# Altium project VFD-Clock.PrjPcb
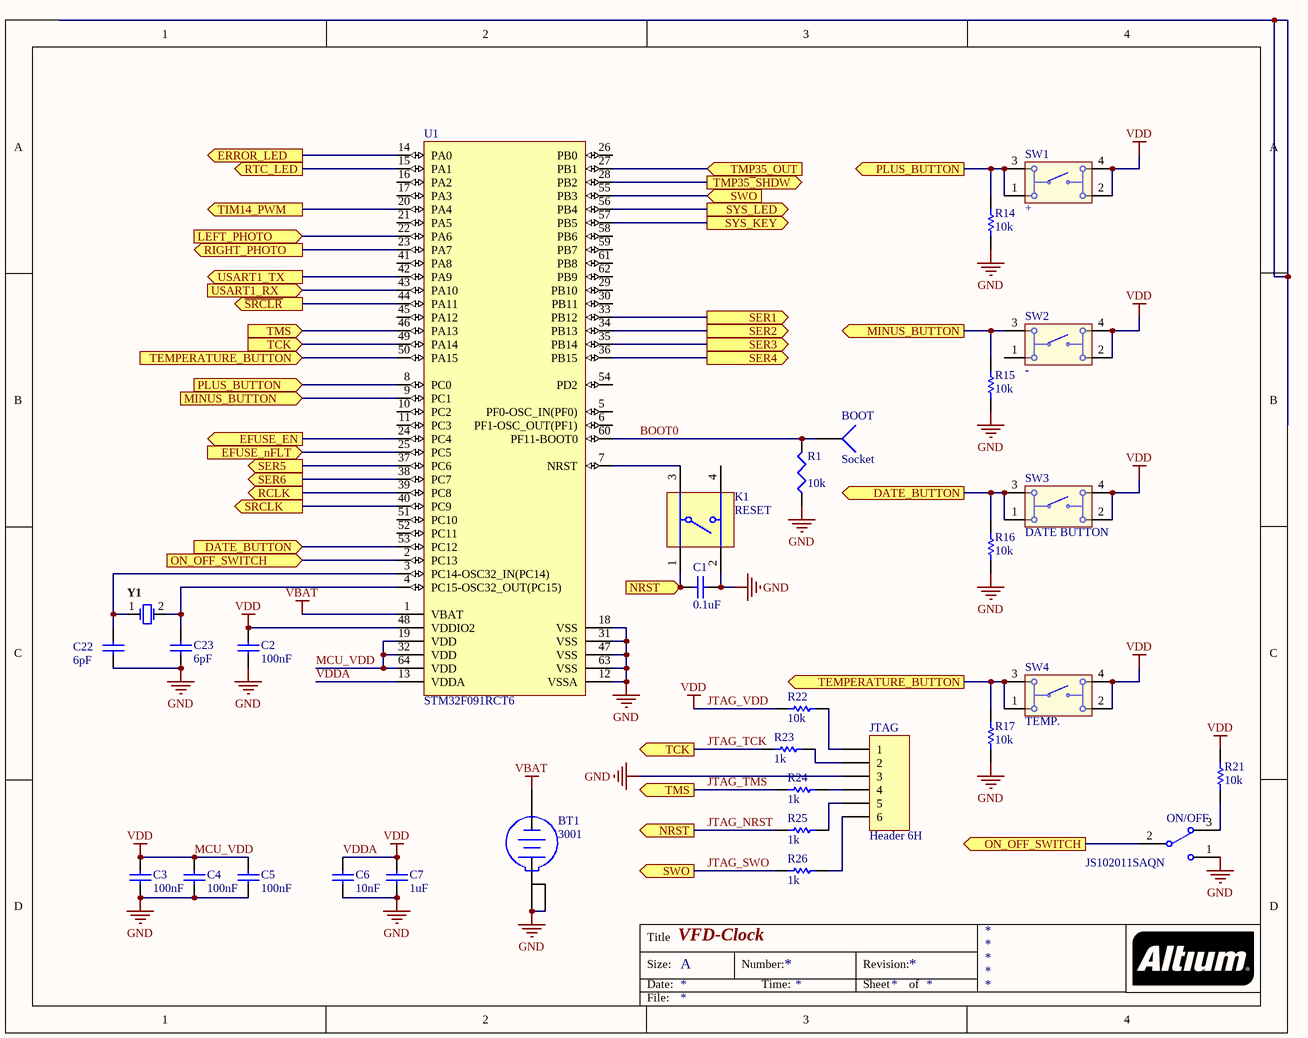
[diagram p0: MCU.SchDoc]
5 sheets, 92 parts. Net scope: flat (ports and power ports of the same name join across sheets).
Board file: VFD_Clock.PcbDoc
Sheets:
  MCU.SchDoc
  Tubes 1-3.SchDoc
  Tubes4-6.SchDoc
  BLE_Sensors_LEDs.SchDoc
  Power.SchDoc

## Sheet MCU.SchDoc: VFD-Clock
size A; Author: Jack Danielski

### Parts
BOOT  Socket  [PIN1]
BT1  3001  [KSTN-3001_V]
C1  0.1uF  [CAPC1608X90X40ML10T20]
C2  100nF  [CAPC1608X90X40ML10T20]
C3  100nF  [CAPC1608X90X40ML10T20]
C4  100nF  [CAPC1608X90X40ML10T20]
C5  100nF  [CAPC1608X90X40ML10T20]
C6  10nF  [CAPC1608X90X40ML10T20]
C7  1uF  [CAPC1608X90X20LL10]
C22  6pF  [CAPC1608X90X40ML10T20]
C23  6pF  [CAPC1608X90X40ML10T20]
JTAG  Header 6H  [HDR1X6H]
K1  RESET  [PNSC-EVPAA_V]
ON/OFF  JS102011SAQN  [CKCP-JS102011SAQN-3_V]
R1  value 10k  [J1-0603]
R14  10k  [RESC1608X55X30LL20T20]
R15  10k  [RESC1608X55X30LL20T20]
R16  10k  [RESC1608X55X30LL20T20]
R17  10k  [RESC1608X55X30LL20T20]
R21  10k  [RESC1608X55X30LL20T20]
R22  10k  [RESC1608X55X30LL20T20]
R23  1k  [RESC1608X55X30LL20T20]
R24  1k  [RESC1608X55X30LL20T20]
R25  1k  [RESC1608X55X30LL20T20]
R26  1k  [RESC1608X55X30LL20T20]
SW1  +  [434331045822]
SW2  -  [434331045822]
SW3  DATE BUTTON  [434331045822]
SW4  TEMP.  [434331045822]
U1  STM32F091RCT6  [STM-LQFP64_L]
Y1  ABS07-120-32.768KHZ-T  [ABRA-ABS07_A_V]  (value not drawn)

### Ports
DATE_BUTTON (in), DATE_BUTTON (out), EFUSE_EN (out), EFUSE_nFLT (in), ERROR_LED (out), LEFT_PHOTO (in), MINUS_BUTTON (in), MINUS_BUTTON (out), NRST (in), NRST (out), ON_OFF_SWITCH (in), ON_OFF_SWITCH (out), PLUS_BUTTON (in), PLUS_BUTTON (out), RCLK (out), RIGHT_PHOTO (out), RTC_LED (out), SER1 (out), SER2 (out), SER3 (out), SER4 (out), SER5 (out), SER6 (out), SRCLK (out), SWO (in), SWO (out), SYS_KEY (out), SYS_LED (out), TCK (in), TCK (out), TEMPERATURE_BUTTON (in), TEMPERATURE_BUTTON (out), TIM14_PWM (out), TMP35_OUT (in), TMP35~{_}SHDW (out), TMS (in), TMS (out), USART1_RX (in), USART1_TX (out), ~{SRCLR} (out)

### Nets
GND: BT1.1(+) BT1.2(+) C1.2 C2.1 C3.1 C4.1 C5.1 C6.2 C7.1 C22.1 C23.1 JTAG.3 K1.2(B) ON/OFF.1 R1.1 R14.1 R15.1 R16.1 R17.1 U1.12(VSSA) U1.18(VSS) U1.31(VSS) U1.47(VSS) U1.63(VSS)
JTAG_VDD: C2.2 C3.2 C4.2 C5.2 C6.1 C7.2 R21.2 R22.2 SW1.2 SW1.4 SW2.2 SW2.4 SW3.2 SW3.4 SW4.2 SW4.4 U1.13(VDDA) U1.19(VDD) U1.32(VDD) U1.48(VDDIO2) U1.64(VDD)  [also labelled MCU_VDD, VDD, VDDA]
VBAT: BT1.3(-) U1.1(VBAT)
BOOT0: BOOT.1 R1.2 U1.60(PF11-BOOT0)
JTAG_NRST: C1.1 K1.1(A) R25.2 ; port NRST
JTAG_SWO: R26.2 U1.55(PB3) ; port SWO
JTAG_TCK: R23.2 U1.49(PA14) ; port TCK
JTAG_TMS: R24.2 U1.46(PA13) ; port TMS
NetC22_2: C22.2 U1.3(PC14-OSC32_IN(PC14)) Y1.1
NetC23_2: C23.2 U1.4(PC15-OSC32_OUT(PC15)) Y1.2
NetJTAG_1: JTAG.1 R22.1
NetJTAG_2: JTAG.2 R23.1
NetJTAG_4: JTAG.4 R24.1
NetJTAG_5: JTAG.5 R25.1
NetJTAG_6: JTAG.6 R26.1
NetK1_3: K1.3(A') U1.7(NRST)
NetON/OFF_2: ON/OFF.2 U1.2(PC13) ; port ON_OFF_SWITCH
NetON/OFF_3: ON/OFF.3 R21.1
NetQ1_1: U1.22(PA6) ; port LEFT_PHOTO
NetQ2_1: U1.23(PA7) ; port RIGHT_PHOTO
NetR2_2: U1.56(PB4) ; port SYS_LED
NetR3_2: U1.57(PB5) ; port SYS_KEY
NetR6_2: U1.14(PA0) ; port ERROR_LED
NetR7_2: U1.15(PA1) ; port RTC_LED
NetR14_2: R14.2 SW1.1 SW1.3 U1.8(PC0) ; port PLUS_BUTTON
NetR15_2: R15.2 SW2.3 U1.9(PC1) ; port MINUS_BUTTON
NetR16_2: R16.2 SW3.1 SW3.3 U1.53(PC12) ; port DATE_BUTTON
NetR17_2: R17.2 SW4.1 SW4.3 U1.50(PA15) ; port TEMPERATURE_BUTTON
NetR18_1: U1.25(PC5) ; port EFUSE_nFLT
NetU1_20: U1.20(PA4) ; port TIM14_PWM
NetU1_27: U1.27(PB1) ; port TMP35_OUT
NetU1_28: U1.28(PB2) ; port TMP35~{_}SHDW
NetU1_33: U1.33(PB12) ; port SER1
NetU1_34: U1.34(PB13) ; port SER2
NetU1_35: U1.35(PB14) ; port SER3
NetU1_36: U1.36(PB15) ; port SER4
NetU1_37: U1.37(PC6) ; port SER5
NetU1_38: U1.38(PC7) ; port SER6
NetU1_39: U1.39(PC8) ; port RCLK
NetU1_40: U1.40(PC9) ; port SRCLK
NetU1_42: U1.42(PA9) ; port USART1_TX
NetU1_43: U1.43(PA10) ; port USART1_RX
NetU1_44: U1.44(PA11) ; port ~{SRCLR}
NetU_3: U1.24(PC4) ; port EFUSE_EN

Not connected (* = marked no-connect by the designer): K1 4(B'); SW2 1; U1 5(PF0-OSC_IN(PF0)) 6(PF1-OSC_OUT(PF1)) 10(PC2) 11(PC3) 16(PA2) 17(PA3) 21(PA5) 26(PB0) 29(PB10) 30(PB11) 41(PA8) 45(PA12) 51(PC10) 52(PC11) 54(PD2) 58(PB6) 59(PB7) 61(PB8) 62(PB9)

### Notes on the sheet
- Title
- Size:
- Date:
- A
- Number:
- Time:
- Revision:
- Sheet
- of
- File:

### Library data of the parts
BT1 = CMP-2000-05463-1: Holder Battery Coin, 12 mm, 2-Pin THD, RoHS; Manufacturer: Keystone; Package Reference: 3001; Package Description: 2-Pin Through Hole Device, Body 13.21 x 12.07 mm; Datasheet Version: Rev. H, 09/2006; Datasheet URL: https://datasheet.ciiva.com/3/3001-3954.pdf; Mounting Technology: ThroughHole; Manufacturer URL: http://www.keyelco.com/
C1-C5 C22 C23 = CMP-2000-05002-1: Ceramic Multilayer Capacitor, 100 nF, +/- 10%, 50 V, -55 to 155 degC, 0603 (1608 Metric), RoHS, Tape and Reel; Manufacturer: Yageo; Online Catalog: CCSeries; Voltage - Rated: 16V; Product Training Modules: MultilayerCeramicCapacitors; Other Names: 311-1088-6; Featured Product: CommodityMultilayerCeramicCapacitors–CCSeries; Capacitance: 0.1µF; Temperature Coefficient: X7R; Height - Seated (Max): -; Operating Temperature: -55degC~125degC; Package / Case: 0603(1608Metric); Datasheet URL: https://datasheet.ciiva.com/11786/0900766b80d84f1d-11786077.pdf; Package Description: 2-Pin Surface Mount Device, Body 1.6 x 0.8 mm; Family: CeramicCapacitors; Packaging: Digi-Reel; Size / Dimension: 0.063"Lx0.031"W(1.60mmx0.80mm); Thickness (Max): 0.035"(0.90mm); Series: CC; Lead Spacing: -; Features: -; Tolerance: ±10%; Lead Style: -; Ratings: -; Manufacturer URL: http://www.yageo.com/; Package Reference: 603; Standard Package: 1; Category: Capacitors; Mounting Type: SurfaceMount,MLCC; Applications: GeneralPurpose; Datasheet Version: Rev. 2, 05/2009
C6 = CMP-2100-03600-1: Chip Capacitor, 10 nF, +/- 10%, 50 V, -55 to 125 degC, 0603 (1608 Metric), RoHS, Tape and Reel; Manufacturer: Yageo; Insulation Resistance: 100GR; Dielectric: X7R; Voltage Rating (DC): 50V; Material: Ceramic; Lead Free: LeadFree; Case/Package: 0603; Datasheet Version: Rev. 15, 10/2016; Composition: Ceramic; Radiation Hardening: No; Thickness: 0.035inch; RoHSCompliant: True; Termination: SMD/SMT; Capacitance: 10nF; Manufacturer URL: http://www.yageo.com/; Tolerance: 10%; REACH SVHC: NoSVHC; Voltage: 50V; Max Operating Temperature: 125degC; Case Code (Metric): 1608; Package Quantity: 1; Case Code (Imperial): 0603; Packaging: TapeandReel; Package Reference: 0603; Width: 0.031inch; Datasheet URL: http://www.yageo.com/documents/recent/UPY-GPHC_X7R_6.3V-to-50V_15.pdf; Length: 1.6mm; Min Operating Temperature: -55degC; Number of Pins: 2; Depth: 0.8mm; Mount: SurfaceMount; Height: 0.8mm; Voltage Rating: 50V; Package Description: 2-Pin Surface Mount Device, Body 1.6 x 0.8 mm
C7 = CMP-2000-06025-1: Chip Capacitor, 1 uF, +/- 10%, 50 V, -55 to 85 degC, 0603 (1608 Metric), RoHS, Tape and Reel; Manufacturer: TDK; PCN Part Number: MLCCPartNumberChange30/Nov/2012; Other Names: 445-7468-6; Online Catalog: CSeries,GeneralPurpose; Capacitance: 1µF; Product Training Modules: CSeriesGeneralApplicationsSEAT,CCV,andTVCLDesignToolsGuidetoReplacinganElectrolyticCapacitorwithanMLCC; Voltage - Rated: 50V; Design Resources: 20WNon-IsolatedBuckLEDDriverUsingPLLNK460KG; Temperature Coefficient: X5R; Series: C; Datasheet Version: 08/2016; Package Description: 2-Pin Surface Mount Device, Body 1.6 x 0.8 mm; Mounting Technology: SurfaceMount; Features: -; Size / Dimension: 0.063"Lx0.031"W(1.60mmx0.80mm); Lead Spacing: -; Operating Temperature: -55°C~85°C; Tolerance: ±10%; Height - Seated (Max): -; Mounting Type: SurfaceMount,MLCC; Ratings: -; Standard Package: 1; Applications: GeneralPurpose; Datasheet URL: https://product.tdk.com/info/en/catalog/datasheets/mlcc_commercial_general_en.pdf; Category: Capacitors; Lead Style: -; Packaging: Digi-Reel®; RoHS Information: RoHSCertificate-MLCC; Package / Case: 0603(1608Metric); Package Reference: 0603; Manufacturer URL: http://www.tdk.com/; Thickness (Max): 0.035"(0.90mm); Family: CeramicCapacitors
JTAG = Header 6H: Header, 6-Pin, Right Angle; LatestRevisionDate: 17-Jul-2002; LatestRevisionNote: Re-released for DXP Platform.; Publisher: Altium Limited
K1 = CMP-2000-06231-1: Light Touch Switch, 100 mOhm, -40 to 85 degC, 4-Pin SMD, RoHS, Tape and Reel; Manufacturer: Panasonic; Part No: EVP-AA002K; Electrical Life: 1000000Cycles; Switch Configuration: N.O.; COO: JP; Actuator Color: Black; Contact Rating @ Voltage: 0.02@15VDCA; Dielectric Strength: 250VAC; Actuator Length: 0.3mm; Ground Terminal: No; Operating Force: 1N; Pole Throw Configuration: SPST; Body Orientation: Straight; Illumination Type: N/R; Maximum DC Voltage Rating: 15V; Actuator Style: RectangularButton; Maximum AC Voltage Rating: N/A; Package Description: 4-Pin Surface Mount Device, Body 2.9 x 3.5 mm, Pitch 1.45 mm; Family: EVPAA; Contact Material: N/A; Mounting: SurfaceMount,J-Bend; Datasheet Version: 04/2016; Housing Material: N/A; Product Weight: N/A; RoHS: Yes; Mechanical Life: N/A; Minimum Insulation Resistance: 100MOhm; Operating Temperature: -40to85C; Mounting Technology: SurfaceMount; HTS: 8507204000; Dimension: 4.3x2.9x1.7mm; Maximum Contact Resistance: 100mOhm; Base Material: N/A; Seal Location: N/A; Supplier Standard Pack: 5,000; Supplier: PanasonicIndustrialDevices; Datasheet URL: https://industrial.panasonic.com/cdbs/www-data/pdf/ATV0000/ATV0000C1.pdf; Packaging: EmbossedTapeandReel; Manufacturer URL: http://www.panasonic.com/; Seal Description: N/A; Contact Plating: N/A; ECCN: EAR99; Package Reference: EVPAA; Type: LightTouch
ON/OFF = CMP-2000-06501-1: Sub-Miniature Slide Switch, SPDT, -40 to 85 degC, 3-Pin SMD, RoHS, Tape and Reel; Manufacturer: C&K Components; Electrical Life: 15000Cycles; Actuator Color: Black; Body Orientation: RightAngle; Minimum Insulation Resistance: 100MOhm; Contact Rating @ Voltage: 0.3@6VDCA; Actuator Style: SideSlide; Maximum DC Voltage Rating: 6V; COO: US; Actuator Material: Nylon4/6; Dielectric Strength: 500VAC; Maximum Contact Resistance: 70mOhm; Base Material: N/A; Mounting Technology: SurfaceMount; Switch Configuration: N/A; Package Reference: SMT; Package Description: 3-Pin Surface Mount Device, Body 9 x 3.6 mm, Height 3.5 mm; Mounting: SurfaceMount,GullWing; Part No: JS102011SAQN; Dimension: 9x4.3mm; Type: Sub-Miniature; Product Weight: N/A; Seal Location: N/A; Family: JS; ECCN: EAR99; Supplier: C&KComponents; Seal Description: N/A; Contact Plating: Silver; Pole Throw Configuration: SPDT; Packaging: TapeandReel; Manufacturer URL: http://www.ckswitches.com/; Datasheet URL: https://datasheet.ciiva.com/1532/js-9dec14-1532400.pdf; Maximum AC Voltage Rating: N/A; Mechanical Life: N/A; HTS: 8536509050; Datasheet Version: 12/2014; Housing Material: Nylon4/6; Contact Material: CopperAlloy; RoHS: Yes; Operating Temperature: -40to85C
R1 = Res3: Resistor; Published: 8-Jun-2000; LatestRevisionDate: 29-May-2009; LatestRevisionNote: IPC-7351 Footprint Added.; PackageReference: J1-0603; Publisher: Altium Limited; PackageDescription: Chip Resistor
R14-R17 R21-R26 = CMP-2000-00873-1: Manufacturer: Panasonic; Part Number: ERA3AEB102V
SW1-SW4 = CMP-1461-00001-1: WS-TASU SMD Tact Switch 4.7X3.5 mm side push; Manufacturer: Wuerth Elektronik; NoPins: 04; ComponentLink1Description: Manufacturer URL; ComponentLink2Description: Datasheet; PartNumber: 434331045822; PackageReference: 434331045822; ComponentLink2URL: http://katalog.we-online.de/em/datasheet/434331045822.pdf; ComponentLink1URL: http://www.we-online.com
U1 = CMP-0304-00199-2: ARM Cortex-M0 32-bit MCU, 256 KB Flash, 32 KB Internal RAM, 52 I/Os, 64-Pin LQFP, -40 to 85 degC, Tray; Manufacturer: STMicroelectronics; I/Os (High Current): 52; FLASH Size (Prog) (kB): 256; Operating Frequency(F) (Processor speed) (MHz): 48; D/A Converter: 1; Supply Voltage(Vcc) min (V): 2; Internal RAM Size (kB): 32; ComponentLink2Description: Datasheet; ComponentLink1Description: Manufacturer URL; Package Reference: LQFP64; Core: ARM Cortex-M0; PartNumber: STM32F091RCT6; Package Description: 64-Pin Low-profile Quad Flat Package, Body 10 x 10 mm, Pitch 0.5 mm; ComponentLink1URL: http://www.st.com/; ComponentLink2URL: http://www.st.com/st-web-ui/static/active/en/resource/technical/document/datasheet/DM00115237.pdf; DatasheetVersion: Rev. 2; Mounting Technology: Surface Mount; Packing: Tray
Y1 = CMP-2000-07587-1: Tuning Fork Crystal, 32.768 KHz, +/- 20 ppm, -40 to 85 degC, 2-Pin SMD, RoHS, Tape and Reel; Manufacturer: Abracon; Case\/Package: SMD/SMT; Series Resistance: 60KOhm; Frequency Tolerance: 20ppm; Load Capacitance: 6pF; ESR (Equivalent Series Resistance): 55KOhm; Max Operating Temperature: 85degC; Width: 0.061inch; Radiation Hardening: No; Lead Free: LeadFree; RoHSCompliant: True; Depth: 1.5mm; Datasheet URL: http://www.abracon.com/Resonators/ABS07-120-32.768kHz-T.pdf; Frequency: 32.768KHz; Termination: SMD/SMT; Manufacturer URL: http://www.abracon.com/; Package Quantity: 3000; Packaging: TapeandReel; Number of Pins: 2; Height: 0.035inch; Package Description: 2-Pin Surface Mount Device, Body 3.2 x 1.5 mm; Package Reference: ABS07; Mount: SurfaceMount; Tolerance: 20ppm; Mounting Technology: SurfaceMount; REACH SVHC: NoSVHC; Datasheet Version: 11/2014; Length: 3.2mm; Min Operating Temperature: -40degC
BOOT = Socket: LatestRevisionDate: 17-Jul-2002; LatestRevisionNote: Re-released for DXP Platform.; Publisher: Altium Limited

## Sheet Tubes 1-3.SchDoc
size A
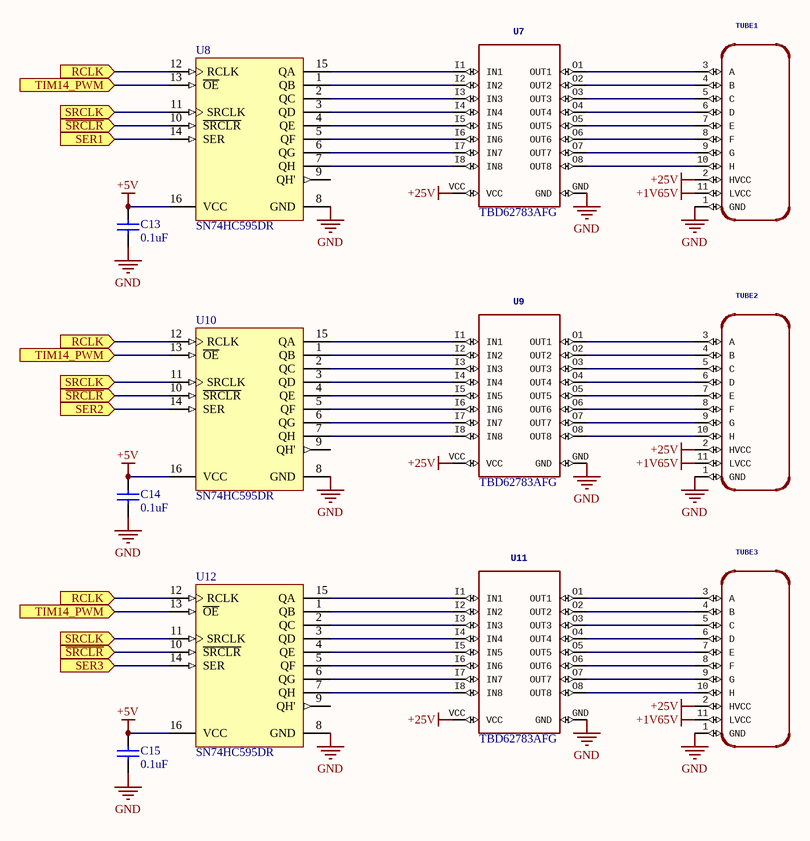
[diagram p1: Tubes 1-3.SchDoc]

### Parts
C13  0.1uF  [CAPC1608X90X40ML10T20]
C14  0.1uF  [CAPC1608X90X40ML10T20]
C15  0.1uF  [CAPC1608X90X40ML10T20]
TUBE1  VFD-IV-11  [VFD-IV11]  (value not drawn)
TUBE2  VFD-IV-11  [VFD-IV11]  (value not drawn)
TUBE3  VFD-IV-11  [VFD-IV11]  (value not drawn)
U7  TBD62783AFG  [TBD62783AFG]
U8  SN74HC595DR  [D0016A_N]
U9  TBD62783AFG  [TBD62783AFG]
U10  SN74HC595DR  [D0016A_N]
U11  TBD62783AFG  [TBD62783AFG]
U12  SN74HC595DR  [D0016A_N]

### Ports
RCLK (in), SER1 (in), SER2 (in), SER3 (in), SRCLK (in), TIM14_PWM (in), ~{SRCLR} (in)

### Nets
+1V65V: TUBE1.11(LVCC) TUBE2.11(LVCC) TUBE3.11(LVCC)
+5V: C13.2 C14.2 C15.2 U8.16(VCC) U10.16(VCC) U12.16(VCC)
+25V: TUBE1.2(HVCC) TUBE2.2(HVCC) TUBE3.2(HVCC) U7.VCC U9.VCC U11.VCC
GND: C13.1 C14.1 C15.1 TUBE1.1(GND) TUBE2.1(GND) TUBE3.1(GND) U7.GND U8.8(GND) U9.GND U10.8(GND) U11.GND U12.8(GND)
NetTUBE1_3: TUBE1.3(A) U7.O1(OUT1)
NetTUBE1_4: TUBE1.4(B) U7.O2(OUT2)
NetTUBE1_5: TUBE1.5(C) U7.O3(OUT3)
NetTUBE1_6: TUBE1.6(D) U7.O4(OUT4)
NetTUBE1_7: TUBE1.7(E) U7.O5(OUT5)
NetTUBE1_8: TUBE1.8(F) U7.O6(OUT6)
NetTUBE1_9: TUBE1.9(G) U7.O7(OUT7)
NetTUBE1_10: TUBE1.10(H) U7.O8(OUT8)
NetTUBE2_3: TUBE2.3(A) U9.O1(OUT1)
NetTUBE2_4: TUBE2.4(B) U9.O2(OUT2)
NetTUBE2_5: TUBE2.5(C) U9.O3(OUT3)
NetTUBE2_6: TUBE2.6(D) U9.O4(OUT4)
NetTUBE2_7: TUBE2.7(E) U9.O5(OUT5)
NetTUBE2_8: TUBE2.8(F) U9.O6(OUT6)
NetTUBE2_9: TUBE2.9(G) U9.O7(OUT7)
NetTUBE2_10: TUBE2.10(H) U9.O8(OUT8)
NetTUBE3_3: TUBE3.3(A) U11.O1(OUT1)
NetTUBE3_4: TUBE3.4(B) U11.O2(OUT2)
NetTUBE3_5: TUBE3.5(C) U11.O3(OUT3)
NetTUBE3_6: TUBE3.6(D) U11.O4(OUT4)
NetTUBE3_7: TUBE3.7(E) U11.O5(OUT5)
NetTUBE3_8: TUBE3.8(F) U11.O6(OUT6)
NetTUBE3_9: TUBE3.9(G) U11.O7(OUT7)
NetTUBE3_10: TUBE3.10(H) U11.O8(OUT8)
NetU1_20: U8.13(~{OE}) U10.13(~{OE}) U12.13(~{OE}) ; port TIM14_PWM
NetU1_33: U8.14(SER) ; port SER1
NetU1_34: U10.14(SER) ; port SER2
NetU1_35: U12.14(SER) ; port SER3
NetU1_39: U8.12(RCLK) U10.12(RCLK) U12.12(RCLK) ; port RCLK
NetU1_40: U8.11(SRCLK) U10.11(SRCLK) U12.11(SRCLK) ; port SRCLK
NetU1_44: U8.10(~{SRCLR}) U10.10(~{SRCLR}) U12.10(~{SRCLR}) ; port ~{SRCLR}
NetU7_I1: U7.I1(IN1) U8.15(QA)
NetU7_I2: U7.I2(IN2) U8.1(QB)
NetU7_I3: U7.I3(IN3) U8.2(QC)
NetU7_I4: U7.I4(IN4) U8.3(QD)
NetU7_I5: U7.I5(IN5) U8.4(QE)
NetU7_I6: U7.I6(IN6) U8.5(QF)
NetU7_I7: U7.I7(IN7) U8.6(QG)
NetU7_I8: U7.I8(IN8) U8.7(QH)
NetU9_I1: U9.I1(IN1) U10.15(QA)
NetU9_I2: U9.I2(IN2) U10.1(QB)
NetU9_I3: U9.I3(IN3) U10.2(QC)
NetU9_I4: U9.I4(IN4) U10.3(QD)
NetU9_I5: U9.I5(IN5) U10.4(QE)
NetU9_I6: U9.I6(IN6) U10.5(QF)
NetU9_I7: U9.I7(IN7) U10.6(QG)
NetU9_I8: U9.I8(IN8) U10.7(QH)
NetU11_I1: U11.I1(IN1) U12.15(QA)
NetU11_I2: U11.I2(IN2) U12.1(QB)
NetU11_I3: U11.I3(IN3) U12.2(QC)
NetU11_I4: U11.I4(IN4) U12.3(QD)
NetU11_I5: U11.I5(IN5) U12.4(QE)
NetU11_I6: U11.I6(IN6) U12.5(QF)
NetU11_I7: U11.I7(IN7) U12.6(QG)
NetU11_I8: U11.I8(IN8) U12.7(QH)

Not connected (* = marked no-connect by the designer): U8 9(QH'); U10 9(QH'); U12 9(QH')

### Library data of the parts
C13-C15 = CMP-2000-05002-1: as C1 on sheet MCU; Height - Seated (Max): -; Operating Temperature: -55degC~125degC; Package / Case: 0603(1608Metric); Datasheet URL: https://datasheet.ciiva.com/11786/0900766b80d84f1d-11786077.pdf; Package Description: 2-Pin Surface Mount Device, Body 1.6 x 0.8 mm; Family: CeramicCapacitors; Packaging: Digi-Reel; Size / Dimension: 0.063"Lx0.031"W(1.60mmx0.80mm); Thickness (Max): 0.035"(0.90mm); Series: CC; Lead Spacing: -; Features: -; Tolerance: ±10%; Lead Style: -; Ratings: -; Manufacturer URL: http://www.yageo.com/; Package Reference: 603; Standard Package: 1; Category: Capacitors; Mounting Type: SurfaceMount,MLCC; Applications: GeneralPurpose; Datasheet Version: Rev. 2, 05/2009
TUBE1-TUBE3 = VFD-IV-11: GateName_1: G$1; SymbolName_1: VFD-IV11; LibraryName: VFD-Clock; DeviceSetName: VFD-IV-11; Package: VFD-IV11
U7 = TBD62783AFG: TUBE1; GateName_1: G$1; SymbolName_1: TBD62783AFG; LibraryName: TBD62783AFG; DeviceSetName: TBD62783AFG; Package: TBD62783AFG
U8 U10 U12 = CMP-0780-00037-3: 8-Bit Shift Registers With 3-State Output Registers, D0016A, LARGE T&R; Manufacturer: Texas Instruments; Output Drive (IOL/IOH)(Max)(mA): 7.8/-7.8; Rating: Military; ICC @ Nom Voltage(Max)(mA): 0.08; VCC(Min)(V): 2; tpd @ Nom Voltage(Max)(ns): 34; 3-State Output: Yes; Output Type: CMOS; Voltage(Nom)(V): 6; F @ Nom Voltage(Max)(Mhz): 28; Technology Family: HC; Bits: 4; PackageReference: D0016A; Code_JEDEC: MS-012 variation AC; Generic Part Number: SN74HC595; Operating Temperature Range(C): -40 to 85; DatasheetVersion: SCLS041H; PackageVersion: http://www.ti.com/lit/ml/mpds178g/mpds178g.pdf; Input Type: CMOS; VCC(Max)(V): 6
U9 = TBD62783AFG: TUBE2; GateName_1: G$1; SymbolName_1: TBD62783AFG; LibraryName: TBD62783AFG; DeviceSetName: TBD62783AFG; Package: TBD62783AFG
U11 = TBD62783AFG: TUBE3; GateName_1: G$1; SymbolName_1: TBD62783AFG; LibraryName: TBD62783AFG; DeviceSetName: TBD62783AFG; Package: TBD62783AFG

## Sheet Tubes4-6.SchDoc
size A
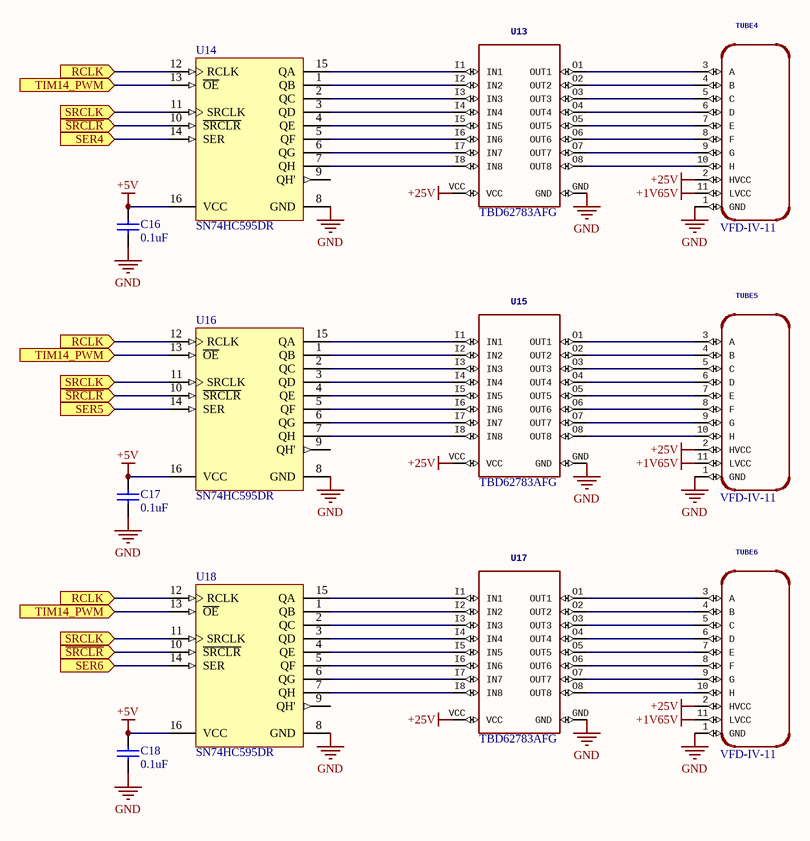
[diagram p2: Tubes4-6.SchDoc]

### Parts
C16  0.1uF  [CAPC1608X90X40ML10T20]
C17  0.1uF  [CAPC1608X90X40ML10T20]
C18  0.1uF  [CAPC1608X90X40ML10T20]
TUBE4  VFD-IV-11  [VFD-IV11]
TUBE5  VFD-IV-11  [VFD-IV11]
TUBE6  VFD-IV-11  [VFD-IV11]
U13  TBD62783AFG  [TBD62783AFG]
U14  SN74HC595DR  [D0016A_N]
U15  TBD62783AFG  [TBD62783AFG]
U16  SN74HC595DR  [D0016A_N]
U17  TBD62783AFG  [TBD62783AFG]
U18  SN74HC595DR  [D0016A_N]

### Ports
RCLK (in), SER4 (in), SER5 (in), SER6 (in), SRCLK (in), TIM14_PWM (in), ~{SRCLR} (in)

### Nets
+1V65V: TUBE4.11(LVCC) TUBE5.11(LVCC) TUBE6.11(LVCC)
+5V: C16.2 C17.2 C18.2 U14.16(VCC) U16.16(VCC) U18.16(VCC)
+25V: TUBE4.2(HVCC) TUBE5.2(HVCC) TUBE6.2(HVCC) U13.VCC U15.VCC U17.VCC
GND: C16.1 C17.1 C18.1 TUBE4.1(GND) TUBE5.1(GND) TUBE6.1(GND) U13.GND U14.8(GND) U15.GND U16.8(GND) U17.GND U18.8(GND)
NetTUBE4_3: TUBE4.3(A) U13.O1(OUT1)
NetTUBE4_4: TUBE4.4(B) U13.O2(OUT2)
NetTUBE4_5: TUBE4.5(C) U13.O3(OUT3)
NetTUBE4_6: TUBE4.6(D) U13.O4(OUT4)
NetTUBE4_7: TUBE4.7(E) U13.O5(OUT5)
NetTUBE4_8: TUBE4.8(F) U13.O6(OUT6)
NetTUBE4_9: TUBE4.9(G) U13.O7(OUT7)
NetTUBE4_10: TUBE4.10(H) U13.O8(OUT8)
NetTUBE5_3: TUBE5.3(A) U15.O1(OUT1)
NetTUBE5_4: TUBE5.4(B) U15.O2(OUT2)
NetTUBE5_5: TUBE5.5(C) U15.O3(OUT3)
NetTUBE5_6: TUBE5.6(D) U15.O4(OUT4)
NetTUBE5_7: TUBE5.7(E) U15.O5(OUT5)
NetTUBE5_8: TUBE5.8(F) U15.O6(OUT6)
NetTUBE5_9: TUBE5.9(G) U15.O7(OUT7)
NetTUBE5_10: TUBE5.10(H) U15.O8(OUT8)
NetTUBE6_3: TUBE6.3(A) U17.O1(OUT1)
NetTUBE6_4: TUBE6.4(B) U17.O2(OUT2)
NetTUBE6_5: TUBE6.5(C) U17.O3(OUT3)
NetTUBE6_6: TUBE6.6(D) U17.O4(OUT4)
NetTUBE6_7: TUBE6.7(E) U17.O5(OUT5)
NetTUBE6_8: TUBE6.8(F) U17.O6(OUT6)
NetTUBE6_9: TUBE6.9(G) U17.O7(OUT7)
NetTUBE6_10: TUBE6.10(H) U17.O8(OUT8)
NetU1_20: U14.13(~{OE}) U16.13(~{OE}) U18.13(~{OE}) ; port TIM14_PWM
NetU1_36: U14.14(SER) ; port SER4
NetU1_37: U16.14(SER) ; port SER5
NetU1_38: U18.14(SER) ; port SER6
NetU1_39: U14.12(RCLK) U16.12(RCLK) U18.12(RCLK) ; port RCLK
NetU1_40: U14.11(SRCLK) U16.11(SRCLK) U18.11(SRCLK) ; port SRCLK
NetU1_44: U14.10(~{SRCLR}) U16.10(~{SRCLR}) U18.10(~{SRCLR}) ; port ~{SRCLR}
NetU13_I1: U13.I1(IN1) U14.15(QA)
NetU13_I2: U13.I2(IN2) U14.1(QB)
NetU13_I3: U13.I3(IN3) U14.2(QC)
NetU13_I4: U13.I4(IN4) U14.3(QD)
NetU13_I5: U13.I5(IN5) U14.4(QE)
NetU13_I6: U13.I6(IN6) U14.5(QF)
NetU13_I7: U13.I7(IN7) U14.6(QG)
NetU13_I8: U13.I8(IN8) U14.7(QH)
NetU15_I1: U15.I1(IN1) U16.15(QA)
NetU15_I2: U15.I2(IN2) U16.1(QB)
NetU15_I3: U15.I3(IN3) U16.2(QC)
NetU15_I4: U15.I4(IN4) U16.3(QD)
NetU15_I5: U15.I5(IN5) U16.4(QE)
NetU15_I6: U15.I6(IN6) U16.5(QF)
NetU15_I7: U15.I7(IN7) U16.6(QG)
NetU15_I8: U15.I8(IN8) U16.7(QH)
NetU17_I1: U17.I1(IN1) U18.15(QA)
NetU17_I2: U17.I2(IN2) U18.1(QB)
NetU17_I3: U17.I3(IN3) U18.2(QC)
NetU17_I4: U17.I4(IN4) U18.3(QD)
NetU17_I5: U17.I5(IN5) U18.4(QE)
NetU17_I6: U17.I6(IN6) U18.5(QF)
NetU17_I7: U17.I7(IN7) U18.6(QG)
NetU17_I8: U17.I8(IN8) U18.7(QH)

Not connected (* = marked no-connect by the designer): U14 9(QH'); U16 9(QH'); U18 9(QH')

### Library data of the parts
C16-C18 = CMP-2000-05002-1: as C1 on sheet MCU; Height - Seated (Max): -; Operating Temperature: -55degC~125degC; Package / Case: 0603(1608Metric); Datasheet URL: https://datasheet.ciiva.com/11786/0900766b80d84f1d-11786077.pdf; Package Description: 2-Pin Surface Mount Device, Body 1.6 x 0.8 mm; Family: CeramicCapacitors; Packaging: Digi-Reel; Size / Dimension: 0.063"Lx0.031"W(1.60mmx0.80mm); Thickness (Max): 0.035"(0.90mm); Series: CC; Lead Spacing: -; Features: -; Tolerance: ±10%; Lead Style: -; Ratings: -; Manufacturer URL: http://www.yageo.com/; Package Reference: 603; Standard Package: 1; Category: Capacitors; Mounting Type: SurfaceMount,MLCC; Applications: GeneralPurpose; Datasheet Version: Rev. 2, 05/2009
TUBE4-TUBE6 = VFD-IV-11: GateName_1: G$1; SymbolName_1: VFD-IV11; LibraryName: VFD-Clock; DeviceSetName: VFD-IV-11; Package: VFD-IV11
U13 = TBD62783AFG: TUBE4; GateName_1: G$1; SymbolName_1: TBD62783AFG; LibraryName: TBD62783AFG; DeviceSetName: TBD62783AFG; Package: TBD62783AFG
U14 U16 U18 = CMP-0780-00037-3: as U8 on sheet Tubes 1-3; PackageReference: D0016A; Code_JEDEC: MS-012 variation AC; Generic Part Number: SN74HC595; Operating Temperature Range(C): -40 to 85; DatasheetVersion: SCLS041H; PackageVersion: http://www.ti.com/lit/ml/mpds178g/mpds178g.pdf; Input Type: CMOS; VCC(Max)(V): 6
U15 = TBD62783AFG: TUBE5; GateName_1: G$1; SymbolName_1: TBD62783AFG; LibraryName: TBD62783AFG; DeviceSetName: TBD62783AFG; Package: TBD62783AFG
U17 = TBD62783AFG: TUBE6; GateName_1: G$1; SymbolName_1: TBD62783AFG; LibraryName: TBD62783AFG; DeviceSetName: TBD62783AFG; Package: TBD62783AFG

## Sheet BLE_Sensors_LEDs.SchDoc
size A
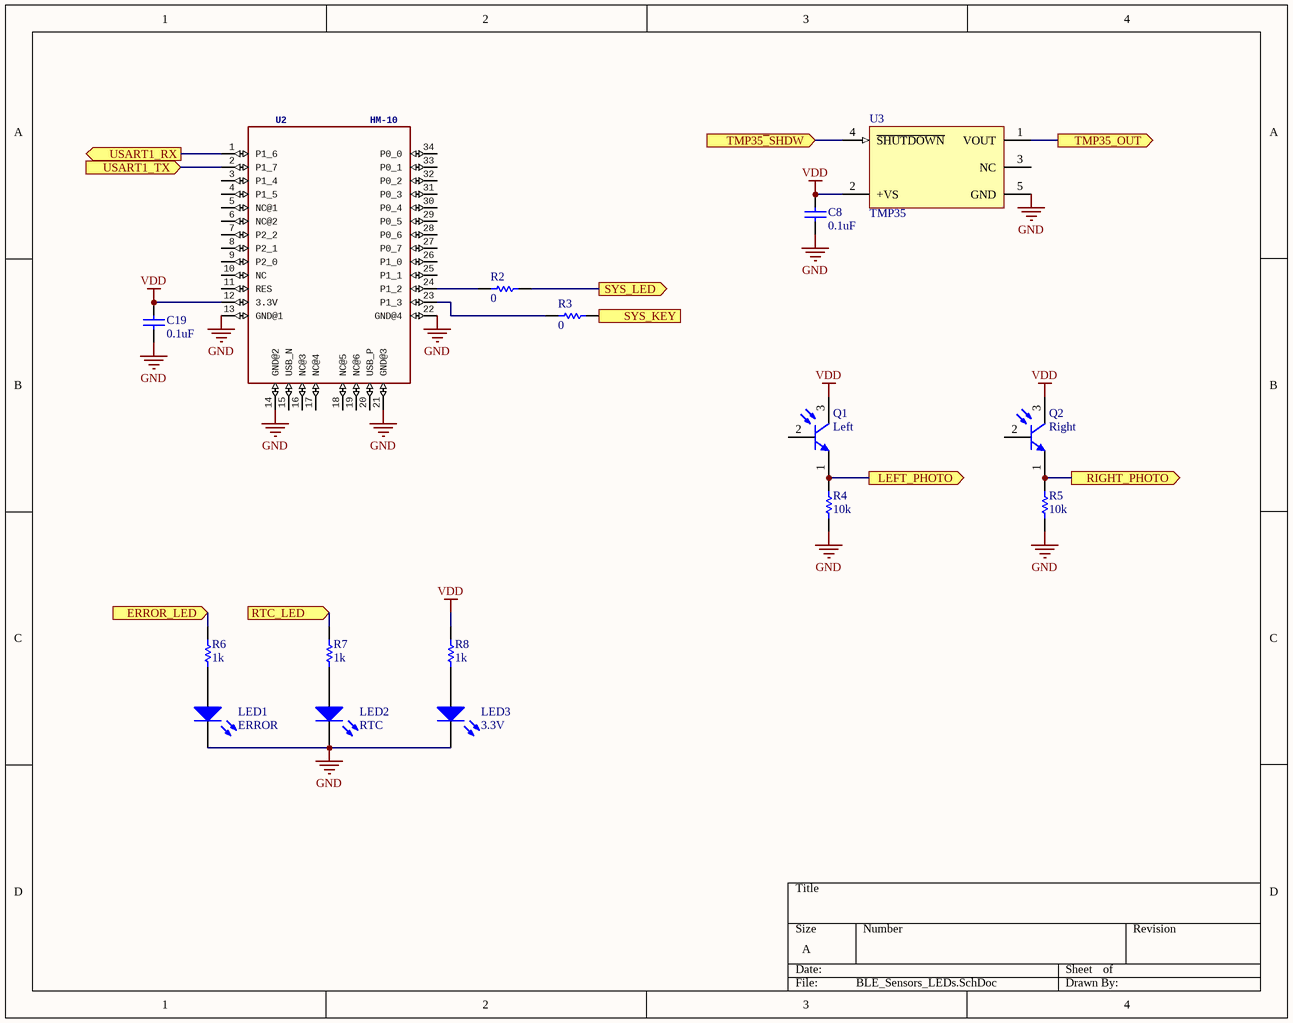
[diagram p3: BLE_Sensors_LEDs.SchDoc]

### Parts
C8  0.1uF  [CAPC1608X90X40ML10T20]
C19  0.1uF  [CAPC1608X90X40ML10T20]
LED1  ERROR  [0805_A]
LED2  RTC  [0805_A]
LED3  3.3V  [0805_A]
Q1  Left  [VSIL-TEMT6000X01_V]
Q2  Right  [VSIL-TEMT6000X01_V]
R2  0  [RESC2013X50X30LL20T20]
R3  0  [RESC2013X50X30LL20T20]
R4  10k  [RESC1608X55X30LL15T15]
R5  10k  [RESC1608X55X30LL15T15]
R6  1k  [RESC1608X55X30LL20T20]
R7  1k  [RESC1608X55X30LL20T20]
R8  1k  [RESC1608X55X30LL20T20]
U2  HM-10  [HM-10]
U3  TMP35  [ADI-RJ-5_M]

### Ports
ERROR_LED (in), LEFT_PHOTO (out), RIGHT_PHOTO (out), RTC_LED (in), SYS_KEY (in), SYS_LED (out), TMP35_OUT (out), TMP35~{_}SHDW (in), USART1_RX (out), USART1_TX (in)

### Nets
GND: C8.1 C19.1 LED1.1(K) LED2.1(K) LED3.1(K) R4.1 R5.1 U2.13(GND@1) U2.14(GND@2) U2.21(GND@3) U2.22(GND@4) U3.5(GND)
VDD: C8.2 C19.2 Q1.3(C) Q2.3(C) R8.2 U2.12(3.3V) U3.2(+VS)  [project net JTAG_VDD]
NetLED1_2: LED1.2(A) R6.1
NetLED2_2: LED2.2(A) R7.1
NetLED3_2: LED3.2(A) R8.1
NetQ1_1: Q1.1(E) R4.2 ; port LEFT_PHOTO
NetQ2_1: Q2.1(E) R5.2 ; port RIGHT_PHOTO
NetR2_1: R2.1 U2.24(P1_2)
NetR2_2: R2.2 ; port SYS_LED
NetR3_1: R3.1 U2.23(P1_3)
NetR3_2: R3.2 ; port SYS_KEY
NetR6_2: R6.2 ; port ERROR_LED
NetR7_2: R7.2 ; port RTC_LED
NetU1_27: U3.1(VOUT) ; port TMP35_OUT
NetU1_28: U3.4(~{SHUTDOWN}) ; port TMP35~{_}SHDW
NetU1_42: U2.2(P1_7) ; port USART1_TX
NetU1_43: U2.1(P1_6) ; port USART1_RX

Not connected (* = marked no-connect by the designer): Q1 2(B); Q2 2(B); U2 3(P1_4) 4(P1_5) 5(NC@1) 6(NC@2) 7(P2_2) 8(P2_1) 9(P2_0) 10(NC) 11(RES) 15(USB_N) 16(NC@3) 17(NC@4) 18(NC@5) 19(NC@6) 20(USB_P) 25(P1_1) 26(P1_0) 27(P0_7) 28(P0_6) 29(P0_5) 30(P0_4) 31(P0_3) 32(P0_2) 33(P0_1) 34(P0_0); U3 3(NC)

### Library data of the parts
C8 C19 = CMP-2000-05002-1: as C1 on sheet MCU; Height - Seated (Max): -; Operating Temperature: -55degC~125degC; Package / Case: 0603(1608Metric); Datasheet URL: https://datasheet.ciiva.com/11786/0900766b80d84f1d-11786077.pdf; Package Description: 2-Pin Surface Mount Device, Body 1.6 x 0.8 mm; Family: CeramicCapacitors; Packaging: Digi-Reel; Size / Dimension: 0.063"Lx0.031"W(1.60mmx0.80mm); Thickness (Max): 0.035"(0.90mm); Series: CC; Lead Spacing: -; Features: -; Tolerance: ±10%; Lead Style: -; Ratings: -; Manufacturer URL: http://www.yageo.com/; Package Reference: 603; Standard Package: 1; Category: Capacitors; Mounting Type: SurfaceMount,MLCC; Applications: GeneralPurpose; Datasheet Version: Rev. 2, 05/2009
LED1-LED3 = CMP-1426-00010-1: SMD mono-color Chip LED, WL-SMCW, Super Red; Manufacturer: Wuerth Elektronik; PartNumber: 150080SS75000; PackageReference: 0805_A; ComponentLink2URL: http://katalog.we-online.com/led/datasheet/150080SS75000.pdf; ComponentLink1URL: http://www.we-online.com; Color: Super Red; ComponentLink2Description: Datasheet; ComponentLink1Description: Manufacturer URL
Q1 Q2 = CMP-1666-00035-1: Ambient Light Sensor / , 100 mW, -40 to 100 degC, 3-Pin SMD, RoHS, Tape and Reel; Nominal Vf: 2 V; Luminous Intensity: 54 mcd; Forward Current: 20 mA; Viewing Angle: 130 degrees; Lens Style: Diffused; Power Rating: 75 mW; Colour: Red; Case\Package: 0603; Case Code (Imperial): 0603; Package Quantity: 3000; Packaging: Tape and Reel; Width: 0.8 mm; ComponentLink2URL: http://www.vishay.com/docs/81579/temt6000.pdf; ComponentLink1Description: Manufacturer URL; ComponentLink2Description: Datasheet; Height: 0.8 mm; Mount: Surface Mount; Pins: 2; Case Code (Metric): 1608; Max Operating Temperature: 85 degC; DatasheetVersion: Rev. 1.9, 08/2011; Forward Voltage: 2 V; ComponentLink1URL: http://www.vishay.com/; Radiation Hardening: No; RoHSCompliant: true; Length: 1.6 mm; PackageReference: 1206; Min Operating Temperature: -55 degC; PackageDescription: 3-Pin Surface Mount Device, Body 4 x 2 mm; Illumination Colour: Red
R2 R3 = CMP-2001-04896-1: Manufacturer: Vishay Dale; Part Number: CRCW08050000Z0EA
R4 R5 = CMP-2000-00181-1: Part Number: ERJ-3EKF1002V; Manufacturer: Panasonic
R6-R8 = CMP-2000-00873-1: as R14 on sheet MCU
U2 = HM-10: GateName_1: G$1; SymbolName_1: HM-10; LibraryName: HM-10_BLE; DeviceSetName: HM-10; Package: HM-10
U3 = CMP-0887-00046-1: Voltage Output Temperature Sensor, 2.7 to 5.5 V Supply, Industrial, 5-pin SOT23 (RJ-5), Reel; PartNumber: TMP35GRTZ-REEL7; Manufacturer: Analog Devices; Mounting Technology: Surface Mount; ComponentLink1URL: http://www.analog.com/en/index.html; ComponentLink2Description: Datasheet; ComponentLink4Description: Product URL; Supply Voltage Range: 2.7 to 5.5 V; ComponentLink1Description: Manufacturer URL; ComponentLink4URL: http://www.analog.com/en/mems-sensors/digital-temperature-sensors/tmp35/products/product.html; ComponentLink3URL: http://www.analog.com/static/imported-files/packages/PKG_PDF/SOT-23(RJ)/RJ_5.pdf; PackageVersion: 121608-A , 12/2008; ComponentLink3Description: Package Specification; PackageReference: RJ-5; ComponentLink2URL: http://www.analog.com/static/imported-files/data_sheets/TMP35_36_37.pdf; DatasheetVersion: Rev. F; Packing: Reel; Code_JEDEC: MO-178-AA; PackageDescription: 5-Pin Small Outline Transistor Package, Body 2.9 x 1.6 mm, Pitch 0.95 mm

## Sheet Power.SchDoc
size A
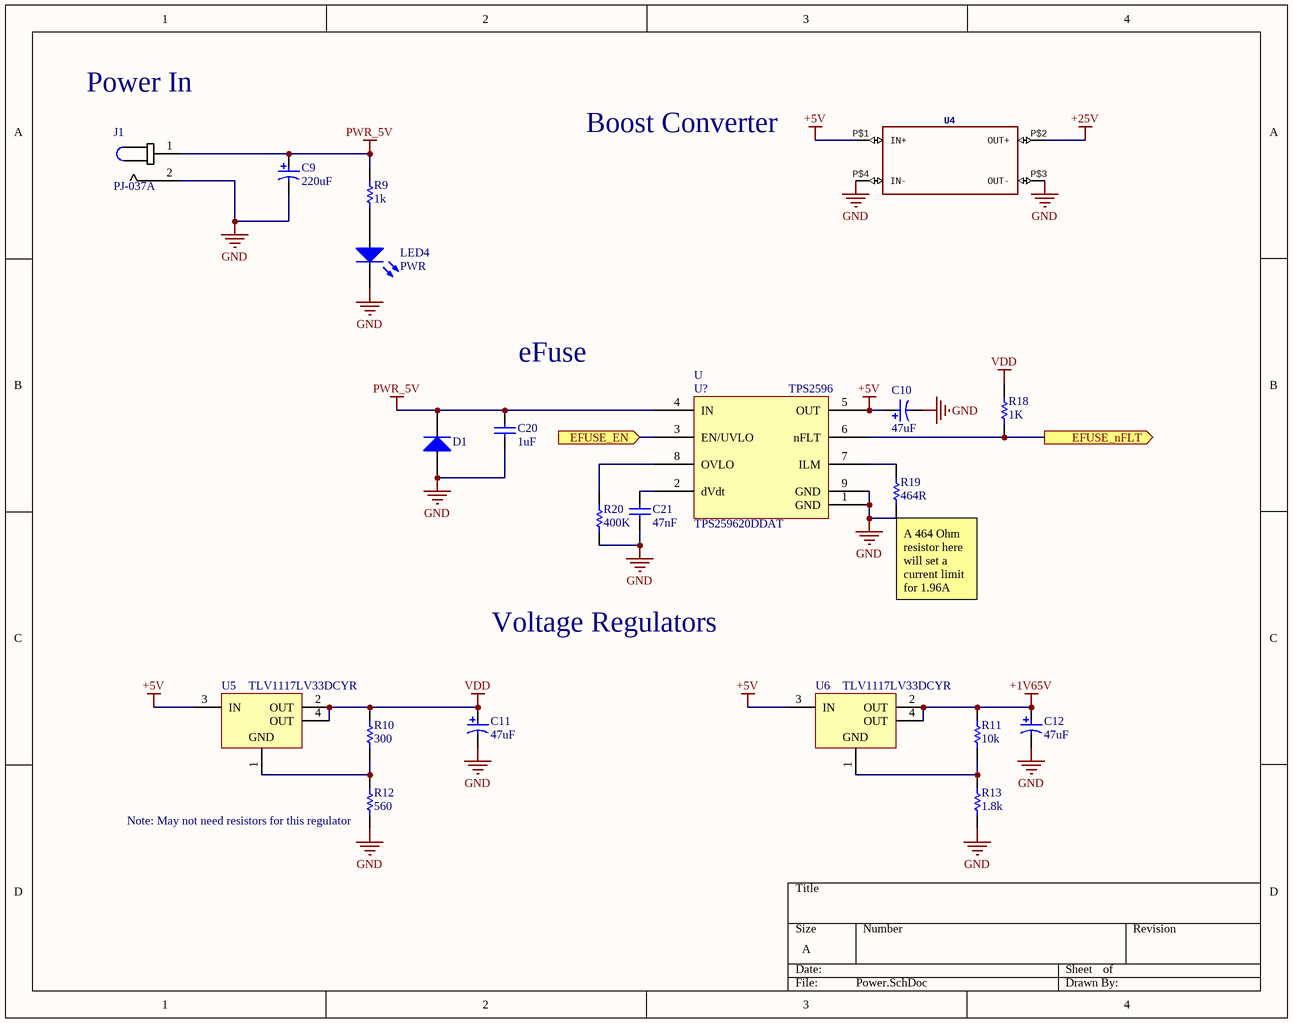
[diagram p4: Power.SchDoc]

### Parts
C9  220uF  [PNSC-FP-V-F_V]
C10  47uF  [PNSC-FP-V-D_V]
C11  47uF  [PNSC-FP-V-D_V]
C12  47uF  [PNSC-FP-V-D_V]
C20  1uF  [CAPC1608X90X20LL10]
C21  47nF  [CAPC1608X90X35ML10T15]
D1  SMAJ5.0A-E3/61  [VISH-DO-214AC-2_M]  (value not drawn)
J1  PJ-037A  [*CUI_PJ-037A]
LED4  PWR  [0805_A]
R9  1k  [RESC1608X55X30LL20T20]
R10  300  [RESC1608X55X30LL15T15]
R11  10k  [RESC1608X55X30LL15T15]
R12  560  [RESC1608X55X30LL20T20]
R13  1.8k  [RESC1609X50X30NL10T20]
R18  1K  [RESC1608X55X30LL15T15]
R19  464R  [RESC1608X55X30LL15T15]
R20  400K  [RESC1608X55X30LL15T15]
U  TPS259620DDAT  [TPS259620DDAT - duplicate]
U4  XL6009E1  [XL6009E1]  (value not drawn)
U5  TLV1117LV33DCYR  [DCY0004A_M]
U6  TLV1117LV33DCYR  [DCY0004A_M]

### Ports
EFUSE_EN (in), EFUSE_nFLT (out)

### Nets
+1V65V: C12.1 R11.2 U6.2(OUT) U6.4(OUT)
+5V: C10.1 U.5(OUT) U4.P$1(IN+) U5.3(IN) U6.3(IN)
+25V: U4.P$2(OUT+)
GND: C9.2 C10.2 C11.2 C12.2 C20.1 C21.1 D1.2(A) J1.2 LED4.1(K) R12.1 R13.2 R19.1 R20.1 U.1(GND) U.9(GND) U4.P$3(OUT-) U4.P$4(IN-)
PWR_5V: C9.1 C20.2 D1.1(K) J1.1 R9.2 U.4(IN)
VDD: C11.1 R10.2 R18.2 U5.2(OUT) U5.4(OUT)  [project net JTAG_VDD]
NetC21_2: C21.2 U.2(dVdt)
NetLED4_2: LED4.2(A) R9.1
NetR10_1: R10.1 R12.2 U5.1(GND)
NetR11_1: R11.1 R13.1 U6.1(GND)
NetR18_1: R18.1 U.6(nFLT) ; port EFUSE_nFLT
NetR19_2: R19.2 U.7(ILM)
NetR20_2: R20.2 U.8(OVLO)
NetU_3: U.3(EN/UVLO) ; port EFUSE_EN

### Notes on the sheet
- Power In
- Boost Converter
- eFuse
- Voltage Regulators
- (near R19) A 464 Ohm resistor here will set a current limit for 1.96A
- (near R12) Note: May not need resistors for this regulator
- (in symbol TI_TPS259620DDAT) U?; TPS2596

### Library data of the parts
C9 = CMP-2000-06215-1: Aluminum Electrolytic Capacitor, 220 uF, +/- 20%, 35 V, 2-Pin SMD (Size Code F), -55 to 105 degC, RoHS, Tape and Reel; Manufacturer: Panasonic; ESR: 0.08ohm; Ripple Current AC: 850mA; Capacitance: 220µF; External Length / Height: 10.2mm; SVHC: ToBeAdvised; Life Time @ Temperature: 2000hours@105°C; Voltage Rating: 35V; Capacitor Case Style: RadialCan-SMD; Leakage Current: 7.7µA; Product Range: PANASONIC-FPSeries; Diameter: 8mm; Datasheet URL: http://industrial.panasonic.com/cdbs/www-data/pdf/RDE0000/ABA0000C1184.pdf; Manufacturer URL: http://www.panasonic.com/; Series: FP; Operating Temperature Max: 105°C; Package Description: 2-Pin Electrolytic Aluminum Capacitor, Body 8.3 x 8.3 mm; Package Reference: FP-V-F; Lifetime @ Temperature: 2000hours@105°C; Operating Temperature Range: -55°Cto+105°C; Package URL: http://industrial.panasonic.com/cdbs/www-data/pdf/RDE0000/DME0000COL48.pdf; Capacitance Tolerance ±: ±20%; AE Capacitor Case: RadialCan-SMD; Height: 10.2mm; Mounting Technology: SurfaceMount; Datasheet Version: 03/2016; Packaging: CutTape; Operating Temperature Min: -55°C; Capacitance Tolerance: ±20%
C10-C12 = CMP-2000-06216-1: Aluminum Electrolytic Capacitor, 47 uF, +/- 20%, 35 V, 2-Pin SMD (Size Code D), -55 to 105 degC, RoHS, Tape and Reel; Manufacturer: Panasonic; Lifetime@Temperature: 2000Hrs@105°C; Capacitance: 47µF; Type: Can; Rated Voltage: 35V; Ripple Current: 300mA; ESR (Equivalent Series Resistance): 0.26O; Package Reference: FP-V-D; Package Description: 2-Pin Electrolytic Aluminum Capacitor, Body 6.6 x 6.6 mm; Datasheet URL: http://industrial.panasonic.com/cdbs/www-data/pdf/RDE0000/ABA0000C1184.pdf; Series: FP; Operating Temp Range: -55to+105°C; Operating Temp-Max: 105°C; Datasheet Version: 03/2016; Manufacturer URL: http://www.panasonic.com/; Package URL: http://industrial.panasonic.com/cdbs/www-data/pdf/RDE0000/DME0000COL48.pdf; Case Size/Dimension: Ø6.3x5.8mm; Mounting Technology: SurfaceMount
C20 = CMP-2000-06025-1: as C7 on sheet MCU; Series: C; Datasheet Version: 08/2016; Package Description: 2-Pin Surface Mount Device, Body 1.6 x 0.8 mm; Mounting Technology: SurfaceMount; Features: -; Size / Dimension: 0.063"Lx0.031"W(1.60mmx0.80mm); Lead Spacing: -; Operating Temperature: -55°C~85°C; Tolerance: ±10%; Height - Seated (Max): -; Mounting Type: SurfaceMount,MLCC; Ratings: -; Standard Package: 1; Applications: GeneralPurpose; Datasheet URL: https://product.tdk.com/info/en/catalog/datasheets/mlcc_commercial_general_en.pdf; Category: Capacitors; Lead Style: -; Packaging: Digi-Reel®; RoHS Information: RoHSCertificate-MLCC; Package / Case: 0603(1608Metric); Package Reference: 0603; Manufacturer URL: http://www.tdk.com/; Thickness (Max): 0.035"(0.90mm); Family: CeramicCapacitors
C21 = CMP-2006-02927-1: Manufacturer: Murata; Part Number: GRM188R71H473KA61D
D1 = CMP-0548-00235-2: Transient Voltage Suppressor, 6.40 to 231 V, 5 V Stand-off Voltage, Uni-Directional, -55 to 155 degC, 2-pin DO-214AC, Pb-Free, Tape and Reel; Manufacturer: Vishay Semiconductor; ID (uA): 800; VBR Uni-Directional (V): 6.4 to 231; IFSM: 40 A; PPPM (W): 400, 300; VWM (V): 5; PackageReference: DO-214AC-2; ComponentLink2URL: http://www.vishay.com/docs/88390/smaj50a.pdf; Operating Junction and Storage Temperature Range: -55 to 150 degC; ComponentLink1Description: Manufacturer URL; PackageDescription: 2-Pin DO-214AC (SMA), Body 4.245 x 2.665 mm; ComponentLink2Description: Datasheet; ComponentLink3URL: http://www.vishay.com/docs/88390/smaj50a.pdf; ComponentLink3Description: Package Specification; RoHS: TRUE; PartNumber: SMAJ5.0A-E3/61; Mounting Technology: Surface Mount; ComponentLink1URL: http://www.vishay.com/; Packing: Tape and Reel; DatasheetVersion: 12/8/2013
LED4 = CMP-1426-00010-1: as LED1 on sheet BLE_Sensors_LEDs; PackageReference: 0805_A; ComponentLink2URL: http://katalog.we-online.com/led/datasheet/150080SS75000.pdf; ComponentLink1URL: http://www.we-online.com; Color: Super Red; ComponentLink2Description: Datasheet; ComponentLink1Description: Manufacturer URL
R9 = CMP-2000-00873-1: as R14 on sheet MCU
R10 R11 R18-R20 = CMP-2000-00411-1: Manufacturer: Panasonic; Part Number: ERJ-3EKF3000V
R12 = CMP-2000-00091-1: Part Number: ERA3AEB561V; Manufacturer: Panasonic
R13 = CMP-2000-03824-1: Manufacturer: Vishay Dale; Part Number: CRCW0603100RFKEA
U = TI_TPS259620DDAT: Texas Instruments TPS259620DDAT; ComponentLink1Description: TI Link; ComponentLink1URL: http://www.ti.com/product/TPS2596
U4 = XL6009E1: GateName_1: G$1; SymbolName_1: XL6009E1; LibraryName: VFD-Clock; DeviceSetName: XL6009E1; Package: XL6009E1
U5 U6 = CMP-0395-00503-2: Single Output LDO, 1 A, Fixed 3.3 V Output, 2 to 5.5 V Input, 4-pin SOT-223 (DCY), -40 to 125 degC, Green (RoHS & no Sb/Br); Manufacturer: Texas Instruments; Vout Adj(Min)(V): 3.3; Vdo(Typ)(mV): 1200; Iq(Typ)(mA): 0.05; Accuracy(%): 2; Iout(Max)(A): 1; SubFamily: Single Channel LDO; Vin(Max)(V): 5.5; PackageReference: DCY0004A; PackageDescription: 4-Pin Plastic Small Outline, Body 3.5 x 6.5 mm, Pitch 2.3 mm; Vout Adj(Max)(V): 3.3; Mounting Technology: Surface Mount; ComponentLink2Description: Datasheet; ComponentLink1Description: Manufacturer URL; PartNumber: TLV1117LV33DCYR; ComponentLink3Description: Package Specification; ComponentLink1URL: http://www.ti.com/; ComponentLink2URL: http://www.ti.com/general/docs/lit/getliterature.tsp?genericPartNumber=TLV1117LV33&fileType=pdf; Fixed Output Options(V): 3.3; PackageVersion: 4202506/B; Vin(Min)(V): 2; DatasheetVersion: SBVS160A; Eco-Plan: Green (RoHS & no Sb/Br); ComponentLink3URL: http://www.ti.com/litv/pdf/mpds094a; Code_JEDEC: TO-261
J1 = PJ-037A: Value: *

## Nets that join several sheets
+1V65V: Tubes 1-3 (TUBE1.11 TUBE2.11 TUBE3.11), Tubes4-6 (TUBE4.11 TUBE5.11 TUBE6.11), Power (C12.1 R11.2 U6.2 U6.4)
+5V: Tubes 1-3 (6 pins), Tubes4-6 (6 pins), Power (5 pins)
+25V: Tubes 1-3 (6 pins), Tubes4-6 (6 pins), Power (U4.P$2)
GND: MCU (24 pins), Tubes 1-3 (12 pins), Tubes4-6 (12 pins), BLE_Sensors_LEDs (12 pins), Power (17 pins)
JTAG_VDD: MCU (21 pins), BLE_Sensors_LEDs (7 pins), Power (5 pins)
NetQ1_1: MCU (U1.22), BLE_Sensors_LEDs (Q1.1 R4.2)
NetQ2_1: MCU (U1.23), BLE_Sensors_LEDs (Q2.1 R5.2)
NetR2_2: MCU (U1.56), BLE_Sensors_LEDs (R2.2)
NetR3_2: MCU (U1.57), BLE_Sensors_LEDs (R3.2)
NetR6_2: MCU (U1.14), BLE_Sensors_LEDs (R6.2)
NetR7_2: MCU (U1.15), BLE_Sensors_LEDs (R7.2)
NetR18_1: MCU (U1.25), Power (R18.1 U.6)
NetU1_20: MCU (U1.20), Tubes 1-3 (U8.13 U10.13 U12.13), Tubes4-6 (U14.13 U16.13 U18.13)
NetU1_27: MCU (U1.27), BLE_Sensors_LEDs (U3.1)
NetU1_28: MCU (U1.28), BLE_Sensors_LEDs (U3.4)
NetU1_33: MCU (U1.33), Tubes 1-3 (U8.14)
NetU1_34: MCU (U1.34), Tubes 1-3 (U10.14)
NetU1_35: MCU (U1.35), Tubes 1-3 (U12.14)
NetU1_36: MCU (U1.36), Tubes4-6 (U14.14)
NetU1_37: MCU (U1.37), Tubes4-6 (U16.14)
NetU1_38: MCU (U1.38), Tubes4-6 (U18.14)
NetU1_39: MCU (U1.39), Tubes 1-3 (U8.12 U10.12 U12.12), Tubes4-6 (U14.12 U16.12 U18.12)
NetU1_40: MCU (U1.40), Tubes 1-3 (U8.11 U10.11 U12.11), Tubes4-6 (U14.11 U16.11 U18.11)
NetU1_42: MCU (U1.42), BLE_Sensors_LEDs (U2.2)
NetU1_43: MCU (U1.43), BLE_Sensors_LEDs (U2.1)
NetU1_44: MCU (U1.44), Tubes 1-3 (U8.10 U10.10 U12.10), Tubes4-6 (U14.10 U16.10 U18.10)
NetU_3: MCU (U1.24), Power (U.3)